# EAGLE schematic 4-layer-microstrip-osh-v2 (EAGLE 9.4.1)
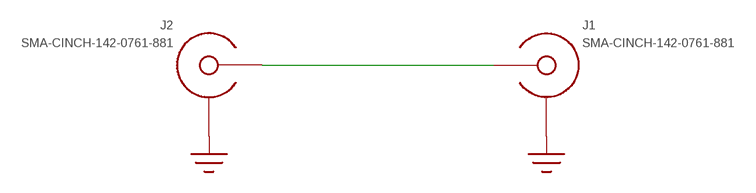
[diagram p0: schematic, sheet 1]

## Parts
J1  SMA-CINCH-142-0761-881  [SMA-CINCH-142-0761-881]
J2  SMA-CINCH-142-0761-881  [SMA-CINCH-142-0761-881]

## Nets
GND: J1.GND@1(SHIELD) J1.GND@2(SHIELD) J1.GND@3(SHIELD) J1.HOLE@1(SHIELD) J1.HOLE@2(SHIELD) J1.HOLE@3(SHIELD) J1.HOLE@4(SHIELD) J1.VIA@1(SHIELD) J1.VIA@2(SHIELD) J1.VIA@3(SHIELD) J1.VIA@4(SHIELD) J1.VIA@5(SHIELD) J1.VIA@6(SHIELD) J2.GND@1(SHIELD) J2.GND@2(SHIELD) J2.GND@3(SHIELD) J2.HOLE@1(SHIELD) J2.HOLE@2(SHIELD) J2.HOLE@3(SHIELD) J2.HOLE@4(SHIELD) J2.VIA@1(SHIELD) J2.VIA@2(SHIELD) J2.VIA@3(SHIELD) J2.VIA@4(SHIELD) J2.VIA@5(SHIELD) J2.VIA@6(SHIELD)
N$3 [12.5-6-cpwg]: J1.CENTER J2.CENTER

## Library data of the parts
J1 J2 = yapo:SMA-CINCH-142-0761-881

## Net classes
1 12.5-6-cpwg: width 0.318 mm, clearance 0.152 mm